# EAGLE design DC-DC Buck Converter Rev1 (EAGLE 8.4.1)
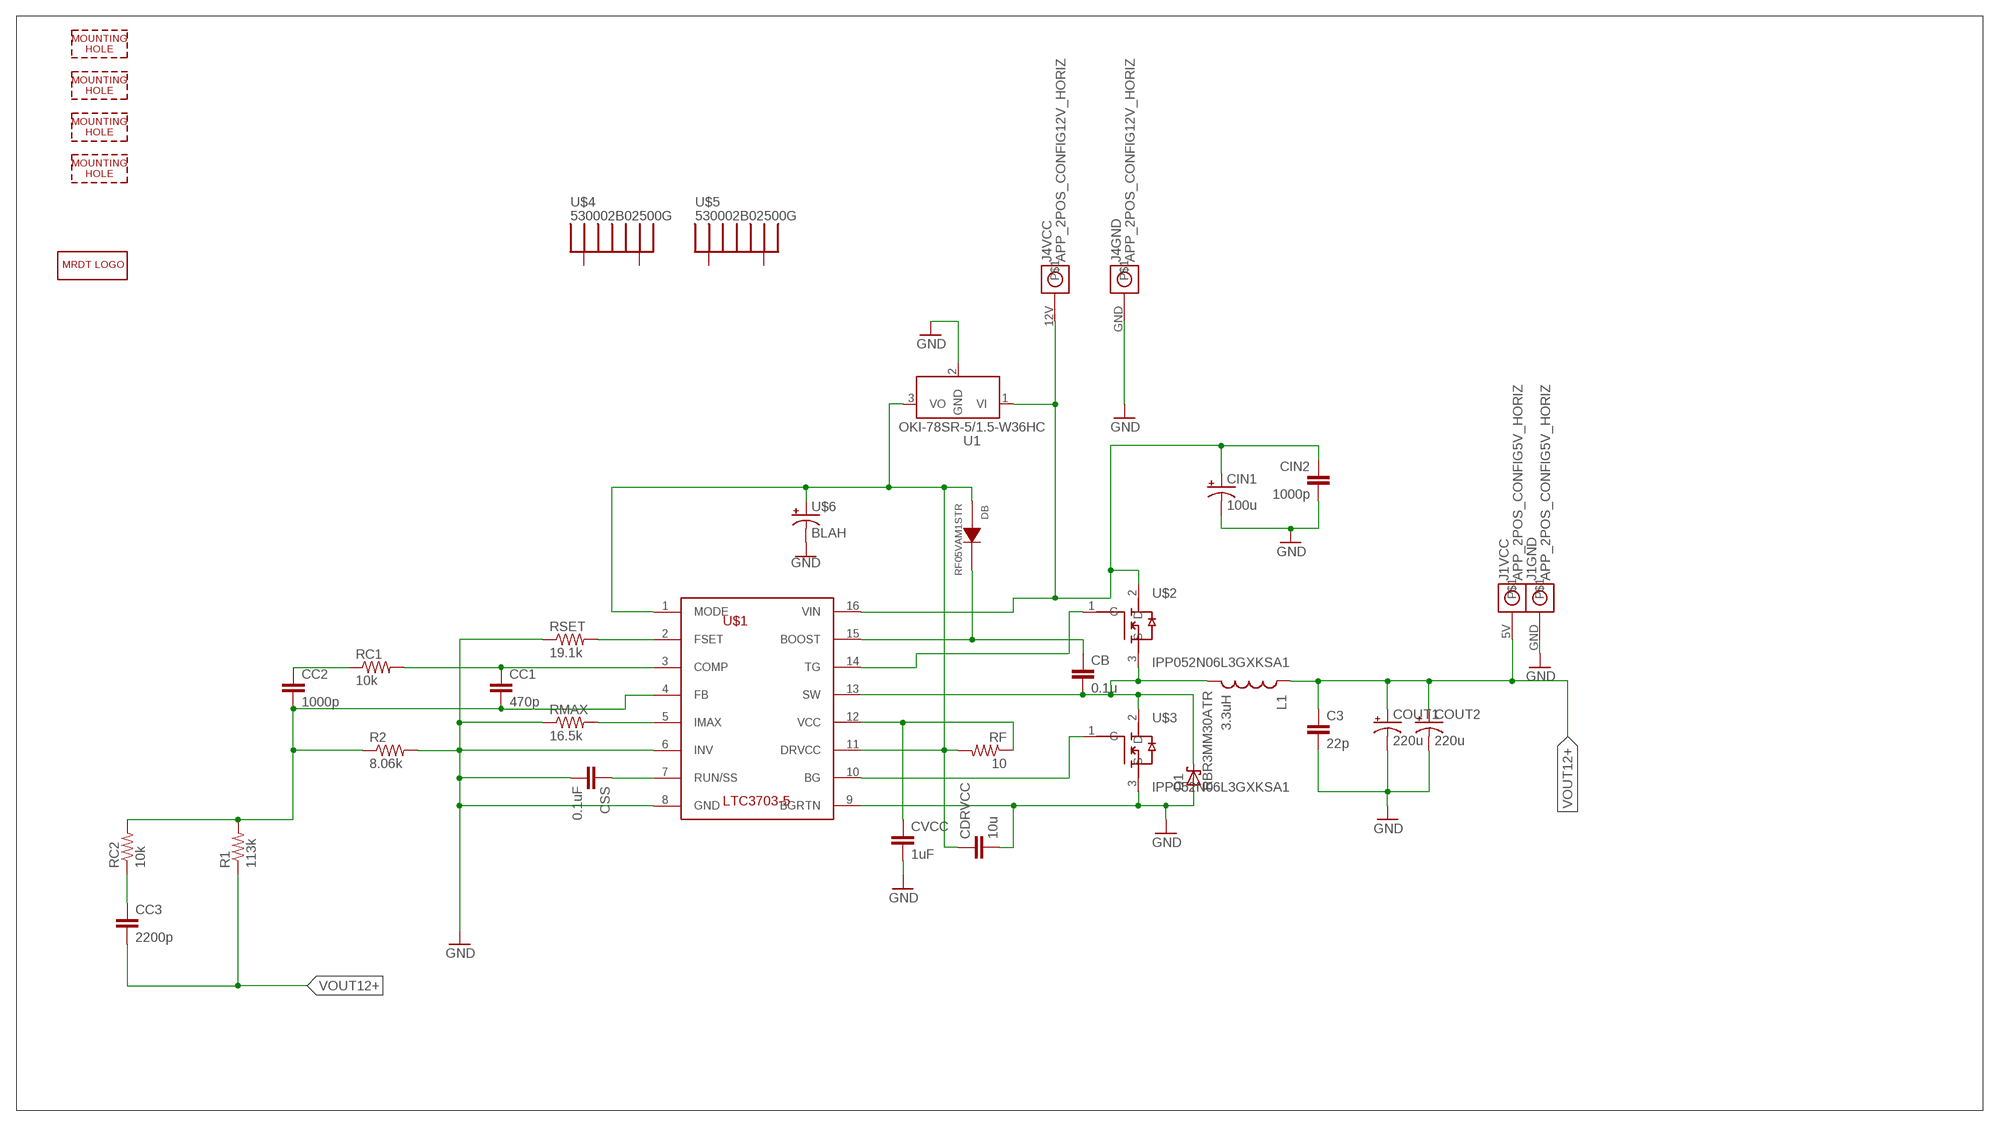
[diagram p0: schematic, sheet 1]

## Parts
C3  22p  CAP0603-CAP  [0603-CAP]
CB  0.1u  CAP0603-CAP  [0603-CAP]
CC1  470p  CAP0603-CAP  [0603-CAP]
CC2  1000p  CAP0603-CAP  [0603-CAP]
CC3  2200p  CAP0603-CAP  [0603-CAP]
CDRVCC  10u  CAP0603-CAP  [0603-CAP]
CIN1  100u  B41858C9107M000  [CAP_POL_220UF]
CIN2  1000p  CAP0603-CAP  [0603-CAP]
COUT1  220u  EGPD101ELL221MK25H  [CAP_POL_220UF]
COUT2  220u  EGPD101ELL221MK25H  [CAP_POL_220UF]
CSS  0.1uF  CAP0603-CAP  [0603-CAP]
CVCC  1uF  CAP0603-CAP  [0603-CAP]
D1  RBR3MM30ATR  [DIODE_SCHOTTKY_30V_1A]
DB  RF05VAM1STR  [DIODE_STANDARD_100V]
H1  MOUNTING_HOLE#8  [#8_SCREW]
H2  MOUNTING_HOLE#8  [#8_SCREW]
H3  MOUNTING_HOLE#8  [#8_SCREW]
H4  MOUNTING_HOLE#8  [#8_SCREW]
J1  APP_2POS_CONFIG5V_HORIZ  [APP45_5V_HORIZ_CONFIG]
J4  APP_2POS_CONFIG12V_HORIZ  [APP45_12V_HORIZ_CONFIG]
L1  3.3uH  PQ3218-3R3-70-T  [PLANAR_INDUCTOR_3.3UH]
LOGO1  MRDT_LOGO  [MRDT_LOGO]
R1  113k  RESISTOR0603-RES  [0603-RES]
R2  8.06k  RESISTOR0603-RES  [0603-RES]
RC1  10k  RESISTOR0603-RES  [0603-RES]
RC2  10k  RESISTOR0603-RES  [0603-RES]
RF  10  RESISTOR0603-RES  [0603-RES]
RMAX  16.5k  RESISTOR0603-RES  [0603-RES]
RSET  19.1k  RESISTOR0603-RES  [0603-RES]
U1  OKI-78SR-5/1.5-W36HC  [OKI-78SR_HORIZ]
U$1  LTC3703-5  [SSOP-16]
U$2  IPP052N06L3GXKSA1  [TO-220]
U$3  IPP052N06L3GXKSA1  [TO-220]
U$4  530002B02500G  [RADIAL_FIN_HEATSINK]
U$5  530002B02500G  [RADIAL_FIN_HEATSINK]
U$6  BLAH  [BLAH]

## Nets
5V: CDRVCC.1 DB.P$2(A) RF.2 U1.3(VO) U$1.1(MODE) U$1.11(DRVCC) U$6.P$2(+)
GND: C3.2 CDRVCC.2 CIN1.GND(-) CIN2.2 COUT1.GND(-) COUT2.GND(-) CSS.2 CVCC.2 D1.P$1(A) J1.GND J4.GND R2.2 RMAX.1 RSET.1 U1.2(GND) U$1.6(INV) U$1.8(GND) U$1.9(BGRTN) U$3.3(S) U$6.P$1(-)
N$1: CB.1 DB.P$1(K) U$1.15(BOOST)
N$2 [fet_drive]: U$1.14(TG) U$2.1(G)
N$3: RSET.2 U$1.2(FSET)
N$4: RMAX.2 U$1.5(IMAX)
N$6: CSS.1 U$1.7(RUN/SS)
N$7: CC1.1 RC1.2 U$1.3(COMP)
N$9: CC2.1 RC1.1
N$10: CC3.1 RC2.1
N$11: CC1.2 CC2.2 R1.2 R2.1 RC2.2 U$1.4(FB)
N$13: CVCC.1 RF.1 U$1.12(VCC)
N$16 [fet_drive]: U$1.10(BG) U$3.1(G)
N$17: CB.2 D1.P$2(C) L1.P$2 U$1.13(SW) U$2.3(S) U$3.2(D)
VBATT: CIN1.+ CIN2.1 J4.12V U1.1(VI) U$1.16(VIN) U$2.2(D)
VOUT12+: C3.1 CC3.2 COUT1.+ COUT2.+ J1.5V L1.P$1 R1.1
Unconnected: U$4.P$1 U$4.P$2 U$5.P$1 U$5.P$2

## Library data of the parts
C3 CB CC1-CC3 CDRVCC CIN2 CSS CVCC = SparkFun-Passives:CAP: Capacitor Standard 0603 ceramic capacitor, and 0.1" leaded capacitor.
CIN1 = buckconverter:B41858C9107M000
COUT1 COUT2 = buckconverter:EGPD101ELL221MK25H
D1 = buckconverter:RBR3MM30ATR
DB = buckconverter:RF05VAM1STR
H1-H4 = MRDT-Hardware:MOUNTING_HOLE: Mounting hole for M6 bolt. Standard use mounting hole for: Tiva C Connected - M6 Anderson Powerpole Mounting Wing - M8 Most frame-mounted PCB's - M8
J1 = MRDT-Connectors:APP_2POS_CONFIG; COLOR1: RED; COLOR2: BLACK
J4 = MRDT-Connectors:APP_2POS_CONFIG; COLOR1: YELLOW; COLOR2: BLACK
L1 = buckconverter:PQ3218-3R3-70-T
LOGO1 = MRDT-Hardware:MRDT_LOGO
R1 R2 RC1 RC2 RF RMAX RSET = SparkFun-Passives:RESISTOR: Resistor Basic schematic elements and footprints for 0603, 1206, and PTH resistors.
U1 = MRDT-ICs:OKI-78SR-*/1.5-W36?C: 4.95W DC/DC Converter Manufacturer: Murata; VOUT: +5v
U$1 = MRDT-ICs:LTC3703-5
U$2 U$3 = buckconverter:IPP052N06L3GXKSA1
U$4 U$5 = buckconverter:530002B02500G
U$6 = buckconverter:BLAH

## Net classes
1 high_current: width 9.525 mm
2 fet_drive: width 0.508 mm, clearance 0.076 mm
3 sample: width 0.127 mm, clearance 0.076 mm

## Board
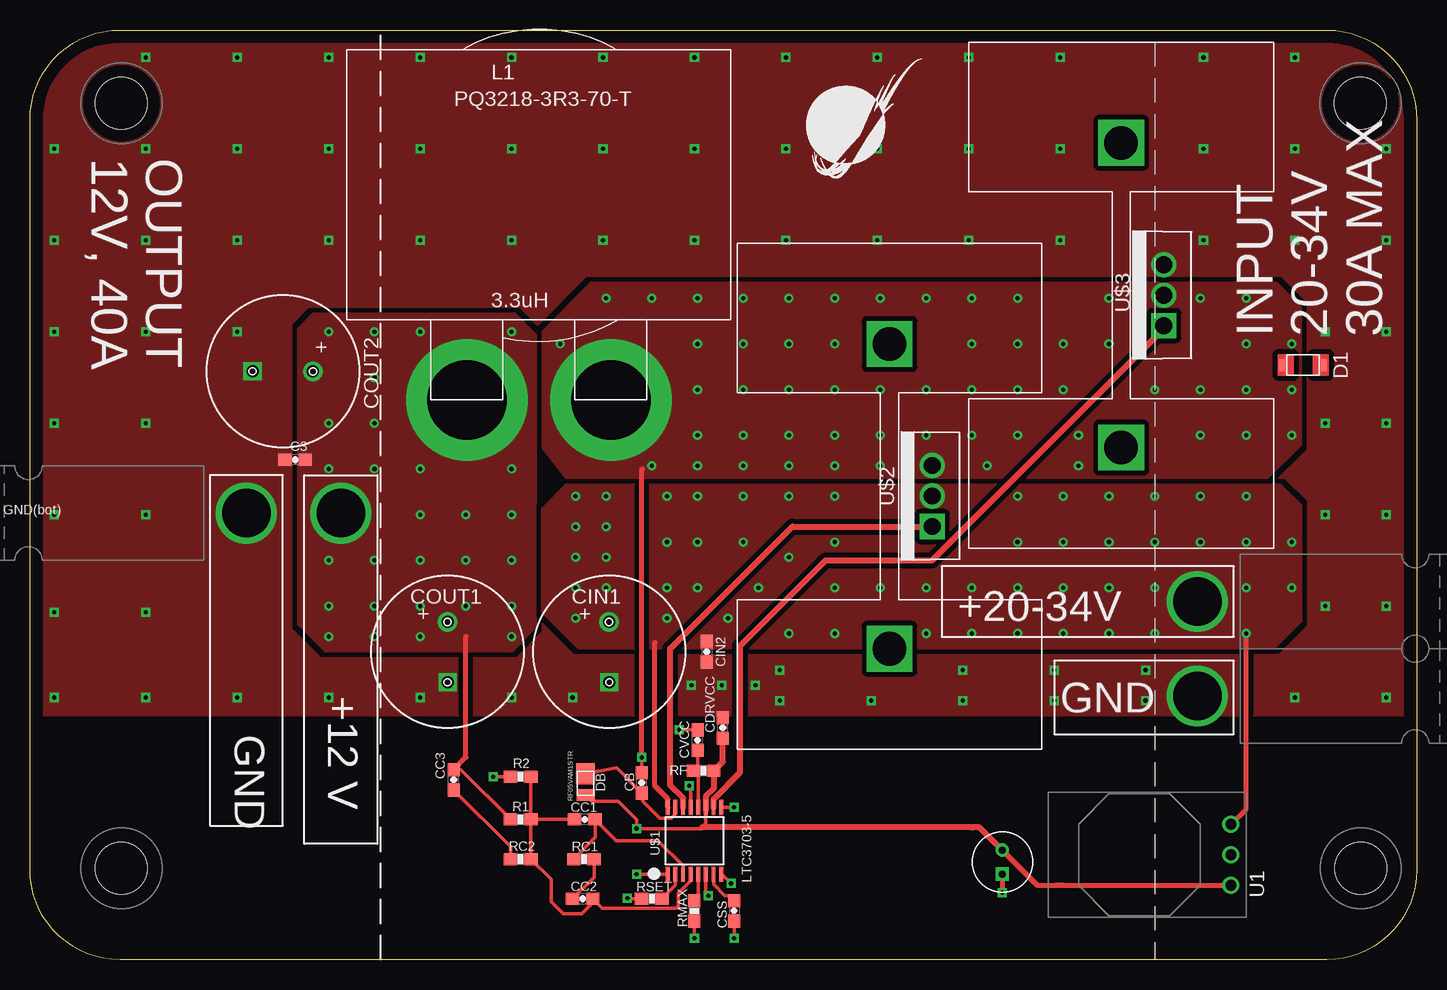
[diagram p1: board, top side]
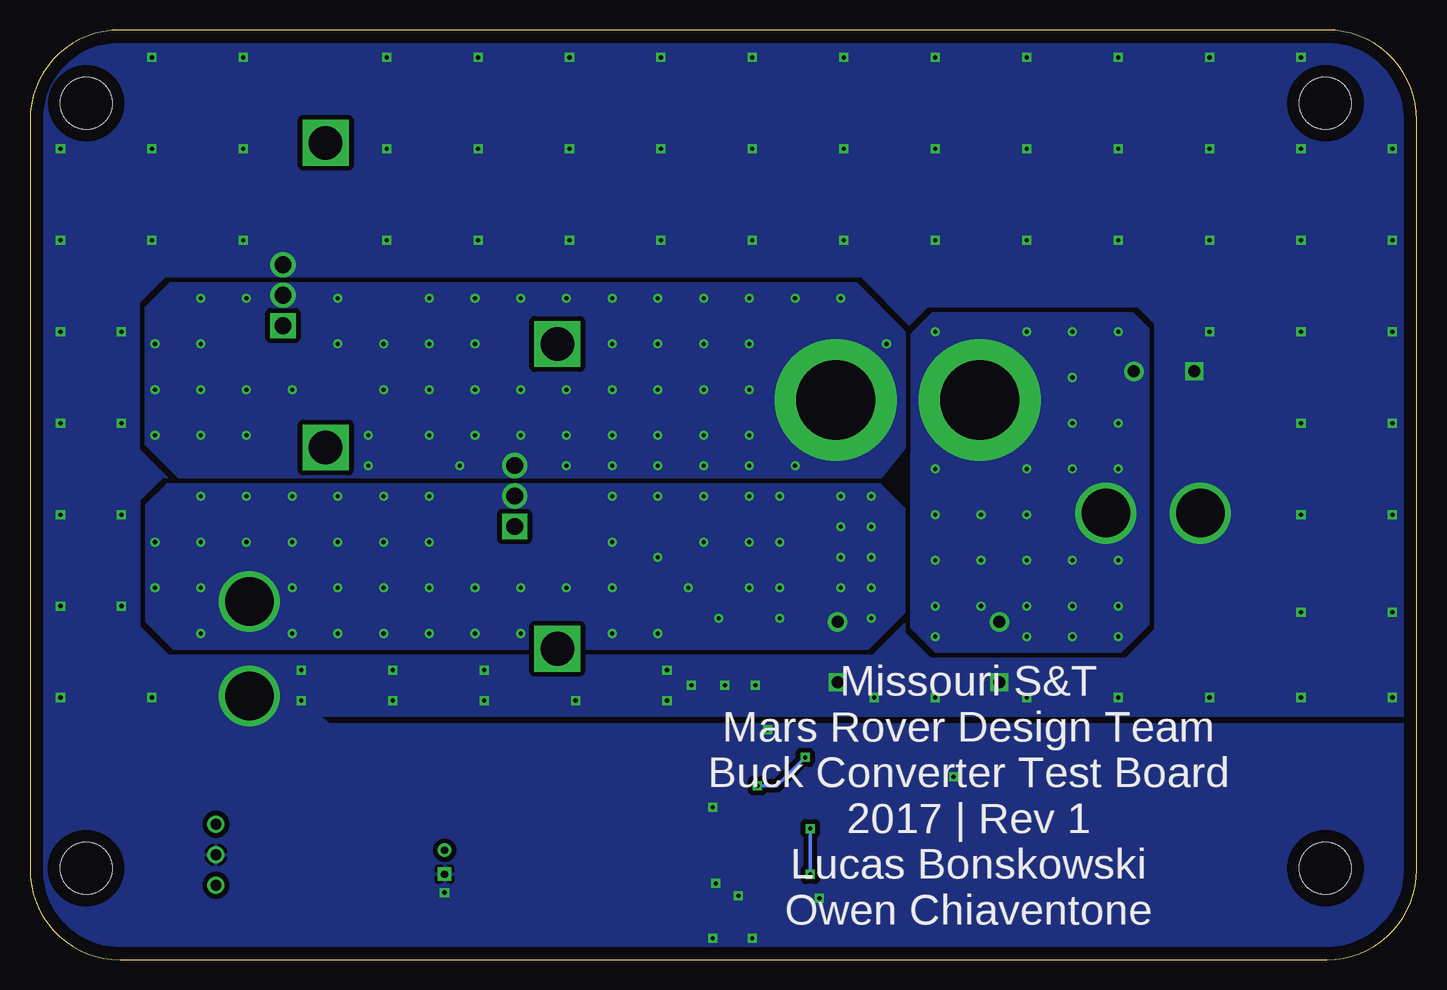
[diagram p2: board, bottom side, seen from below]

Size 115.57 x 77.47 mm. Coordinates in mm from the lower left corner, seen from the top.
Outline: 7.5,77.47 108.07,77.47 arc-90 115.57,69.97 115.57,7.5 arc-90 108.07,0 7.5,0 arc-90 0,7.5 0,69.97 arc-90 7.5,77.47
Copper layers (1*16): Top 0.035mm / dielectric 1.5mm / Bottom 0.035mm
Design rules "advanced_circuits_standard": minimum track width 5mil, minimum drill 10mil, track to track 5mil, track to pad 5mil, pad to pad 5mil, via to via 5mil, smd to smd 5mil, copper to edge 40mil, drill to drill 5mil, minimum pad ring 10mil, minimum via ring 8mil, stop-mask expansion 4mil, vias tented up to drill 0mil, thermal gap 10mil

### Footprints (pad centres in the part's own frame; a part is rotated, then mirrored left to right if it is on the bottom)
0603-CAP = smd 1.1 x 1: 1 -0.85,0; 2 0.85,0
CAP_POL_220UF = drill 1 pad 1.626: + 0,2.489 | drill 1 pad 1.422 square: GND 0,-2.54
DIODE_SCHOTTKY_30V_1A = smd 1.016 x 0.508: P$1 0.889,3.073; P$2 0.889,-0.406
DIODE_STANDARD_100V = smd 1.524 x 1.778: P$1 0.697,1.778 | smd 1.524 x 0.965: P$2 0.711,0
#8_SCREW = hole 4.318: 0,0
APP45_5V_HORIZ_CONFIG = drill 4.064: 5V 36.068,3.937; GND 28.194,3.937
APP45_12V_HORIZ_CONFIG = drill 4.064: 12V 28.194,3.937; GND 28.194,11.811
PLANAR_INDUCTOR_3.3UH = drill 6.6 pad 10.16: P$1 10,-6.7; P$2 22,-6.7
0603-RES = smd 1.1 x 1: 1 -0.85,0; 2 0.85,0
OKI-78SR_HORIZ = drill 0.9 pad 1.422: 1 0,0; 2 -2.54,0; 3 -5.08,0
SSOP-16 = smd 0.32 x 1.26: 1 -2.223,-2.779; 2 -1.588,-2.779; 3 -0.953,-2.779; 4 -0.318,-2.779; 5 0.317,-2.779; 6 0.952,-2.779; 7 1.587,-2.779; 8 2.222,-2.779; 9 2.222,2.779; 10 1.587,2.779; 11 0.952,2.779; 12 0.317,2.779; 13 -0.318,2.779; 14 -0.953,2.779; 15 -1.588,2.779; 16 -2.223,2.779
TO-220 = drill 1.397 square: 1 -2.54,0 | drill 1.397: 2 0,0; 3 2.54,0
RADIAL_FIN_HEATSINK = drill 2.794 square: P$1 12.7,0; P$2 -12.7,0
BLAH = drill 0.6 square: P$1 -1,0 | drill 0.6: P$2 1,0

### Placement (x,y rotation side)
C3  22.1,41.66 180 top
CB  50.98,14.73 90 top
CC1  46.23,11.68 180 top
CC2  46.05,5.08 0 top
CC3  35.31,14.99 90 top
CDRVCC  57.73,19.3 90 top
CIN1  48.26,25.65 0 top
CIN2  56.39,25.65 270 top
COUT1  34.8,25.65 0 top
COUT2  21.08,49.02 270 top
CSS  58.67,4.06 270 top
CVCC  55.63,18.29 90 top
D1  104.75,50.42 270 top
DB  45.59,13.72 0 top
H1  7.62,7.62 0 top
H2  110.9,7.62 0 top
H3  110.87,71.37 0 top
H4  7.62,71.37 0 top
J1  -10.16,33.27 0 top
J4  125.48,33.78 180 top
L1  26.42,53.34 0 top
LOGO1  64.67,64.26 0 top
R1  40.89,11.68 0 top
R2  40.89,15.24 180 top
RC1  46.15,8.38 180 top
RC2  40.89,8.38 0 top
RF  56.13,15.75 0 top
RMAX  55.37,4.06 90 top
RSET  51.82,5.08 0 top
U1  100.08,11.28 90 top
U$1  55.37,9.91 0 top
U$2  75.18,38.63 90 top
U$3  94.49,55.37 90 top
U$4  90.93,55.37 90 top
U$5  71.63,38.61 90 top
U$6  81.03,8.13 90 top

### Tracks (layer width: path | path; a pad name or v marks a point on that pad's centre or on a via)
5V  (via drill 0.35)
  Top 0.305: U$1.1 50.55,7.13 v50.55,7.11 | 50.57,10.92 55.88,10.92 55.99,11.03 56.32,11.37 56.32,12.48 U$1.11 | 50.57,10.92 v50.55,10.92 | 50.57,10.92 50.57,11.66 49.02,13.21 46.81,13.21 DB.P$2
  Top 0.406: 86.11,6.2 85.5,6.2 | 86.11,6.2 U1.3 | U$6.P$2 83.96,6.2 86.11,6.2
  Top 0.508: 56.32,12.48 56.32,13.64 56.98,14.3 RF.2 57.73,16.5 CDRVCC.1 | 78.49,11.03 78.59,11.03 | 78.49,11.03 55.99,11.03 | U$6.P$2 79.12,11.03 78.49,11.03
  Bottom 0.305: v50.55,7.11 v50.55,10.92
GND  (via drill 0.35)
  Top 0.305: RMAX.1 v55.37,1.78 | CSS.2 v58.67,1.78 | U$1.6 56.32,5.54 v56.53,5.33 | U$1.8 57.64,7.13 v58.42,6.35 | U$1.9 57.61,12.7 v58.67,12.7 | CVCC.2 v54.1,19.15 | R2.2 v38.61,15.24 | RSET.1 49.82,5.08 v49.78,5.12
  Top 0.406: U$6.P$1 v81.03,5.59
  other vias: 2.03,59.94 2.03,52.32 2.03,28.96 9.65,75.18 17.27,75.18 24.89,75.18 32.51,75.18 40.13,75.18 47.75,75.18 85.85,75.18 97.79,75.18 105.41,75.18 113.03,67.56 113.03,59.94 113.03,52.32 9.65,67.56 17.27,67.56 24.89,67.56 24.89,59.94 17.27,59.94 9.65,59.94 9.65,52.32 17.27,52.32 9.65,28.96 32.51,67.56 40.13,67.56 47.75,67.56 47.75,59.94 40.13,59.94 32.51,59.94 85.85,67.56 97.79,67.56 105.41,67.56 105.41,59.94 97.79,59.94 2.03,67.56 2.03,21.84 9.65,21.84 17.27,21.84 24.89,21.84 32.51,21.84 40.13,21.84 55.37,75.18 62.99,75.18 70.61,75.18 78.23,75.18 78.23,67.56 70.61,67.56 62.99,67.56 55.37,67.56 55.37,59.94 62.99,59.94 70.61,59.94 78.23,59.94 85.85,59.94 60.45,22.86 57.66,22.86 2.03,44.7 2.03,37.08 9.65,37.08 9.65,44.7 113.03,44.7 113.03,37.08 113.03,29.46 113.03,21.84 105.41,21.84 107.95,29.46 107.95,37.08 107.95,44.7 107.95,52.32 70.1,21.59 62.48,21.59 62.48,24.13 77.72,24.13 85.34,24.13 85.34,21.59 77.72,21.59 92.96,21.59 92.96,24.13 55.12,22.86 45.21,21.84
  pour Top (isolate 0.406, rank 6, no thermals): 1.02,76.96 117.35,76.96 116.59,20.32 0.25,20.32
  pour Bottom (isolate 0.406, rank 6, no thermals): 1.02,76.96 117.35,76.96 116.59,20.32 0.25,20.32
  pour Bottom (isolate 0.406): -0.51,19.56 -0.51,-0.76 117.86,0.76 117.86,24.64 96.52,24.64 90.68,19.56
N$1
  Top 0.305: DB.P$1 48.88,15.98 CB.1 51.05,13.81 51.05,13.21 52.49,11.78 53.43,11.78 53.78,12.14 U$1.15
N$2
  Top 0.508: U$1.14 54.42,13.47 53.34,14.55 53.34,25.91 63.53,36.09 U$2.1
N$3
  Top 0.305: U$1.2 53.78,6.2 RSET.2
N$4
  Top 0.305: U$1.5 55.69,5.23 RMAX.2
N$6
  Top 0.305: U$1.7 56.96,6.29 57.91,5.33 58.25,5.33 CSS.1
N$7
  Top 0.305: U$1.3 54.42,7.81 52.32,9.91 48.86,9.91 CC1.1 47.12,11.66 47.12,10.2 RC1.2
N$9
  Top 0.305: CC2.1 47,6.88 RC1.1
N$10
  Top 0.305: CC3.1 40.04,9.4 RC2.1
N$11
  Top 0.305: R1.2 RC2.2 43.43,6.69 43.43,4.83 44.45,3.81 45.97,3.81 46.9,4.74 CC2.2 47.68,4.3 53.84,4.3 54,4.46 54,5.53 55.05,6.58 U$1.4 | R1.2 R2.1 | R1.2 CC1.2
N$13
  Top 0.305: 55.63,12.75 U$1.12 55.69,15.72 55.31,15.72 RF.1 55.63,16.09 CVCC.1
N$16
  Top 0.508: U$1.10 56.96,13.38 59.18,15.6 59.18,26.16 66.29,33.27 75.18,33.27 94.49,52.58 U$3.1
N$17  (via drill 0.35)
  Top 0.305: CB.2 v50.98,16.85 | U$1.13 55.05,14.13 v54.95,14.49
  Top 0.406: v50.98,16.85 50.98,40.82 51.05,40.89
  Bottom 0.305: v54.95,14.49 53.34,14.49 v50.98,16.85
  other vias: 48.01,55.12 51.82,55.12 55.63,55.12 59.44,55.12 63.25,55.12 67.06,55.12 70.87,55.12 74.68,55.12 78.49,55.12 82.3,55.12 89.92,55.12 97.54,55.12 101.35,55.12 105.16,51.31 101.35,51.31 101.35,47.5 105.16,47.5 105.16,43.69 101.35,43.69 97.54,43.69 97.54,47.5 93.73,47.5 86.11,47.5 82.3,47.5 82.3,51.31 78.49,51.31 78.49,47.5 74.68,47.5 70.87,47.5 67.06,47.5 67.06,51.31 63.25,51.31 63.25,47.5 59.44,47.5 59.44,51.31 55.63,51.31 55.63,47.5 55.63,43.69 59.44,43.69 63.25,43.69 67.06,43.69 70.87,43.69 74.68,43.69 78.49,43.69 82.3,43.69 86.11,51.31 89.92,51.31 44.2,51.31 87.38,43.69 87.38,41.15 79.76,41.15 67.06,41.15 59.44,41.15 63.25,41.15 55.63,41.15 51.82,41.15 70.87,41.15
  pour Top (isolate 0.406, rank 4, no thermals): 103.89,56.39 46.74,56.39 42.67,52.32 42.67,42.67 44.7,40.13 103.12,40.13 105.92,42.93 105.92,54.36
  pour Bottom (isolate 0.406, rank 4, no thermals): 103.89,56.39 46.74,56.39 42.67,52.32 42.67,42.67 44.7,40.13 103.12,40.13 105.92,42.93 105.92,54.36
VBATT  (via drill 0.35)
  Top 0.406: U$1.16 53.15,13.4 52.07,14.48 52.07,26.42 | U1.1 101.35,12.55 101.35,26.67
  other vias: 45.47,38.61 48.01,38.61 48.01,36.07 45.47,36.07 45.47,33.53 48.01,33.53 48.01,30.99 45.47,30.99 45.47,28.45 55.63,38.61 55.63,34.8 55.63,30.99 59.44,38.61 63.25,38.61 67.06,38.61 59.44,34.8 67.06,34.8 67.06,30.99 70.87,30.99 74.68,30.99 78.49,30.99 82.3,34.8 82.3,30.99 82.3,38.61 86.11,38.61 86.11,34.8 89.92,34.8 89.92,38.61 93.73,38.61 93.73,34.8 97.54,34.8 97.54,38.61 101.35,38.61 101.35,34.8 105.16,34.8 105.16,30.99 101.35,30.99 101.35,27.18 93.73,27.18 89.92,27.18 86.11,27.18 82.3,27.18 86.11,30.99 89.92,30.99 93.73,30.99 78.49,27.18 67.06,27.18 63.25,27.18 74.68,27.18 60.71,30.99 63.25,33.53 58.17,28.45 53.09,28.45 53.09,30.99 53.09,38.61 53.09,34.8
  pour Top (isolate 0.406, rank 3, no thermals): 104.14,39.62 105.92,37.85 105.92,28.19 103.63,25.91 45.72,25.91 42.67,28.96 42.67,37.59 44.7,39.62
  pour Bottom (isolate 0.406, rank 3, no thermals): 104.14,39.62 105.92,37.85 105.92,28.19 103.63,25.91 45.72,25.91 42.67,28.96 42.67,37.59 44.7,39.62
VOUT12+  (via drill 0.35)
  Top 0.305: R1.1 35.89,15.84 CC3.2
  Top 0.406: CC3.2 36.32,16.85 36.32,26.92
  other vias: 24.89,52.32 28.7,52.32 32.51,52.32 28.7,48.51 24.89,44.7 28.7,44.7 40.13,52.32 28.7,40.89 24.89,40.89 32.51,40.89 40.13,40.89 40.13,33.27 40.13,37.08 36.32,37.08 32.51,37.08 32.51,33.27 36.32,33.27 24.89,33.27 28.7,33.27 32.51,29.46 36.32,29.46 40.13,29.46 32.51,26.92 40.13,26.92 28.7,29.46 24.89,29.46 28.7,26.92 24.89,26.92
  pour Top (isolate 0.406, rank 5, no thermals): 22.35,52.58 23.62,53.85 40.39,53.85 42.16,52.07 42.16,27.69 40.13,25.65 24.64,25.65 22.35,27.94
  pour Bottom (isolate 0.406, rank 5, no thermals): 22.35,52.58 23.62,53.85 40.39,53.85 42.16,52.07 42.16,27.69 40.13,25.65 24.64,25.65 22.35,27.94

### Text on the board
tPlace: OUTPUT / 12V, 40A | INPUT / 20-34V / 30A MAX | +20-34V | +12 V | GND | GND
bPlace: Missouri S&T / Mars Rover Design Team / Buck Converter Test Board / 2017 | Rev 1 / Lucas Bonskowski / Owen Chiaventone